# Altium schematic sheet picr22-team-GibiBot-mainboard1.SchDoc
size A4; SheetNumber: 1; SheetTotal: 2
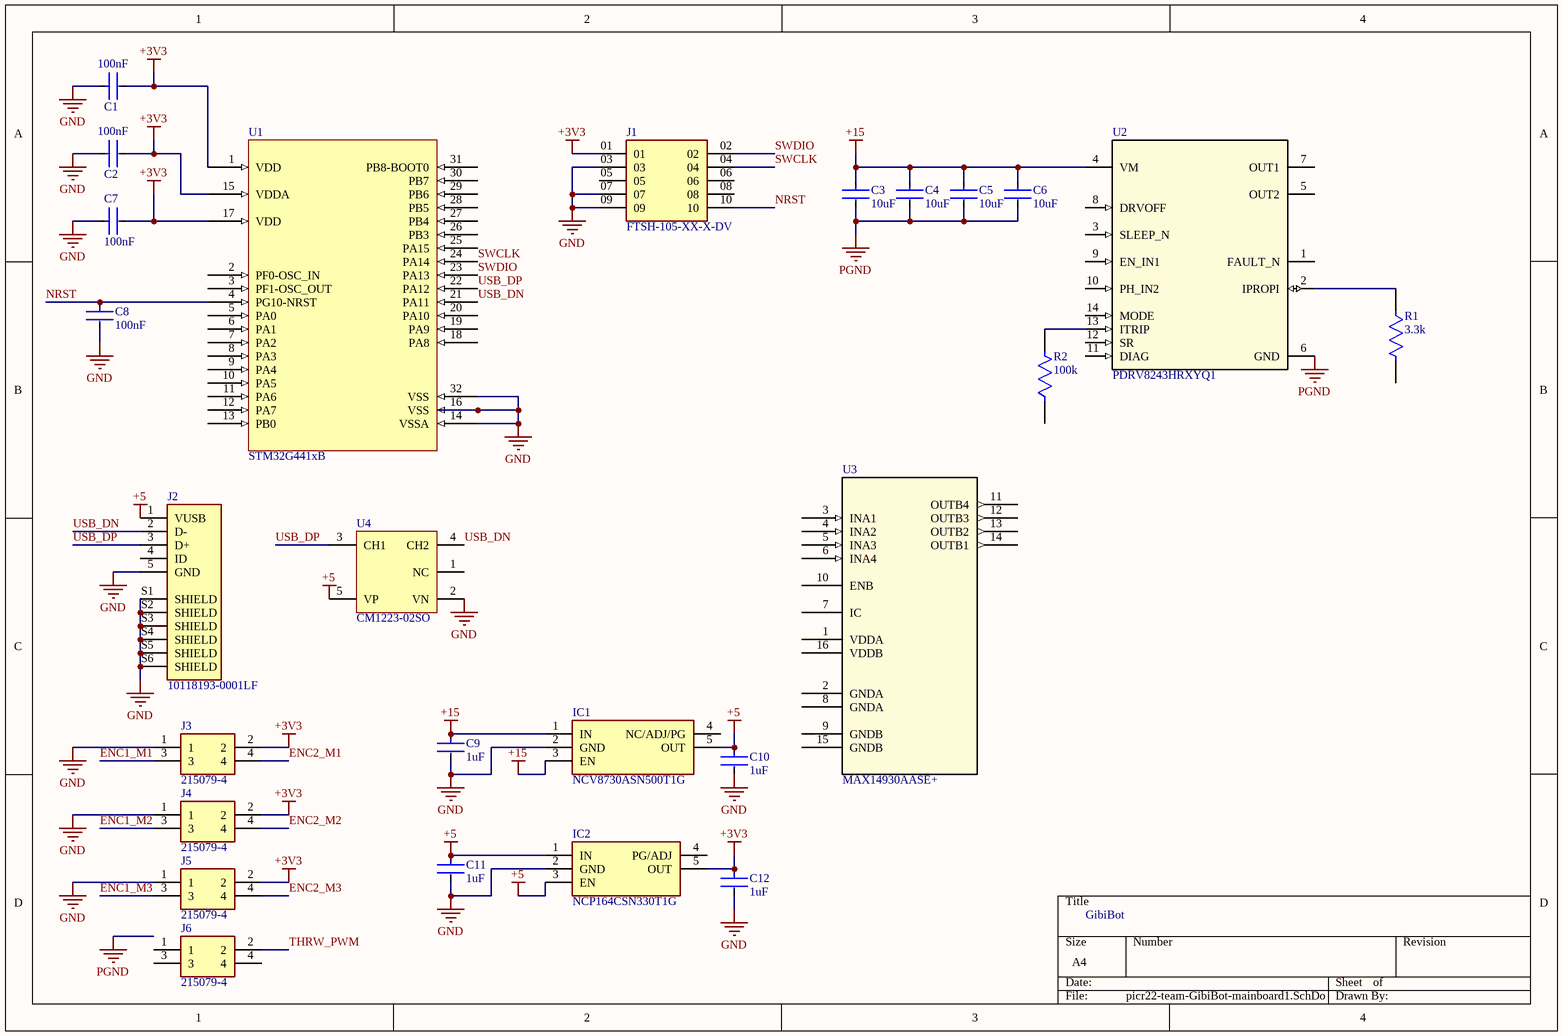
[diagram p0: picr22-team-GibiBot-mainboard1.SchDoc]

## Parts
C1  Capacitance: 100nF  [FP-CGA3E-0_3-0_1-IPC_A]  (hidden comment: CGA3E2X7R1H104K080AA)
C2  Capacitance: 100nF  [FP-CGA3E-0_3-0_1-IPC_A]  (hidden comment: CGA3E2X7R1H104K080AA)
C3  Capacitance: 10uF  [FP-CGA3E-0_3-0_1-IPC_A]  (hidden comment: CGA3E2X7R1H104K080AA)
C4  Capacitance: 10uF  [FP-CGA3E-0_3-0_1-IPC_A]  (hidden comment: CGA3E2X7R1H104K080AA)
C5  Capacitance: 10uF  [FP-CGA3E-0_3-0_1-IPC_A]  (hidden comment: CGA3E2X7R1H104K080AA)
C6  Capacitance: 10uF  [FP-CGA3E-0_3-0_1-IPC_A]  (hidden comment: CGA3E2X7R1H104K080AA)
C7  Capacitance: 100nF  [FP-CGA3E-0_3-0_1-IPC_A]  (hidden comment: CGA3E2X7R1H104K080AA)
C8  Capacitance: 100nF  [FP-CGA3E-0_3-0_1-IPC_A]  (hidden comment: CGA3E2X7R1H104K080AA)
C9  Capacitance: 1uF  [FP-CGA3E-0_3-0_1-IPC_A]  (hidden comment: CGA3E2X7R1H104K080AA)
C10  Capacitance: 1uF  [FP-CGA3E-0_3-0_1-IPC_A]  (hidden comment: CGA3E2X7R1H104K080AA)
C11  Capacitance: 1uF  [FP-CGA3E-0_3-0_1-IPC_A]  (hidden comment: CGA3E2X7R1H104K080AA)
C12  Capacitance: 1uF  [FP-CGA3E-0_3-0_1-IPC_A]  (hidden comment: CGA3E2X7R1H104K080AA)
IC1  NCV8730ASN500T1G  [SOT95P275X110-5N]
IC2  NCP164CSN330T1G  [SOT95P275X110-5N]
J1  FTSH-105-XX-X-DV  [SAMTEC_FTSH-105-XX-X-DV]
J2  10118193-0001LF  [FCI_10118193-0001LF]
J3  215079-4  [TE_215079-4]
J4  215079-4  [TE_215079-4]
J5  215079-4  [TE_215079-4]
J6  215079-4  [TE_215079-4]
R1  Resistance: 3.3k  [FP-CRCW0402-e3-MFG]  (hidden comment: CRCW040232K4FKED)
R2  Resistance: 100k  [FP-CRCW0402-e3-MFG]  (hidden comment: CRCW040232K4FKED)
U1  STM32G441xB  [TQFP80P900X900X160-32N]
U2  PDRV8243HRXYQ1  [RXY0014A-MFG]
U3  MAX14930AASE+  [21-0041_S16+1_MXM]
U4  CM1223-02SO  [ONSC-SOT23-5-527AH-01_L]

## Nets
+3V3: C1.2 C2.2 C7.2 C12.1 IC2.5(OUT) J1.01 J3.2 J4.2 J5.2 U1.1(VDD) U1.15(VDDA) U1.17(VDD)
+5: C10.1 C11.1 IC1.5(OUT) IC2.1(IN) IC2.3(EN) J2.1(VUSB) U4.5(VP)
+15: C3.1 C4.1 C5.1 C6.1 C9.1 IC1.1(IN) IC1.3(EN) U2.4(VM)
GND: C1.1 C2.1 C7.1 C8.2 C9.2 C10.2 C11.2 C12.2 IC1.2(GND) IC2.2(GND) J1.03 J1.07 J1.09 J2.5(GND) J2.S1(SHIELD) J2.S2(SHIELD) J2.S3(SHIELD) J2.S4(SHIELD) J2.S5(SHIELD) J2.S6(SHIELD) J3.1 J4.1 J5.1 U1.14(VSSA) U1.16(VSS) U1.32(VSS) U4.2(VN)
PGND: C3.2 C4.2 C5.2 C6.2 U2.6(GND)
ENC1_M1: J3.3
ENC1_M2: J4.3
ENC1_M3: J5.3
ENC2_M1: J3.4
ENC2_M2: J4.4
ENC2_M3: J5.4
NRST: C8.1 J1.10 U1.4(PG10-NRST)
SWCLK: J1.04 U1.24(PA14)
SWDIO: J1.02 U1.23(PA13)
THRW_PWM: J6.2
USB_DN: J2.2(D-) U1.21(PA11) U4.4(CH2)
USB_DP: J2.3(D+) U1.22(PA12) U4.3(CH1)
NetR1_1: R1.1 U2.2(IPROPI)
NetR2_2: R2.2 U2.13(ITRIP)

Not connected (* = marked no-connect by the designer): IC1 4(NC/ADJ/PG); IC2 4(PG/ADJ); J1 05 06 08; J2 4(ID); J6 1 3 4; R1 2; R2 1; U1 2(PF0-OSC_IN) 3(PF1-OSC_OUT) 5(PA0) 6(PA1) 7(PA2) 8(PA3) 9(PA4) 10(PA5) 11(PA6) 12(PA7) 13(PB0) 18(PA8) 19(PA9) 20(PA10) 25(PA15) 26(PB3) 27(PB4) 28(PB5) 29(PB6) 30(PB7) 31(PB8-BOOT0); U2 1(FAULT_N) 3(SLEEP_N) 5(OUT2) 7(OUT1) 8(DRVOFF) 9(EN_IN1) 10(PH_IN2) 11(DIAG) 12(SR) 14(MODE); U3 1(VDDA) 2(GNDA) 3(INA1) 4(INA2) 5(INA3) 6(INA4) 7(IC) 8(GNDA) 9(GNDB) 10(ENB) 11(OUTB4) 12(OUTB3) 13(OUTB2) 14(OUTB1) 15(GNDB) 16(VDDB); U4 1(NC)

## Notes on the sheet
- GibiBot

## Library data of the parts
C1-C12 = CMP-2000-07546-2: Cap Ceramic 100nF 50V X7R 10% Pad SMD 0603 +125°C Automotive T/R; Weight: 7.1E-05oz; Composition: Ceramic; Max Operating Temperature: 125°C; Termination: SMD/SMT; Dielectric: X7R; Length: 1.6mm; Package Quantity: 1; REACH SVHC: No SVHC; Lead Free: Lead Free; Case Code (Metric): 1608; Min Operating Temperature: -55°C; Packaging: Tape and Reel; Tolerance: 10%; Voltage Rating: 50V; Case Code (Imperial): 0603; Case/Package: 0603; Voltage Rating (DC): 50V; Depth: 0.8mm; Radiation Hardening: No; Ratings: AEC-Q200; Mount: Surface Mount; Voltage: 50V; Thickness: 0.035inch; Width: 0.8mm; Height: 0.8mm
IC1 = NCV8730ASN500T1G: Integrated Circuit; Manufacturer_Name: onsemi; Datasheet Link: https://www.arrow.com/en/products/ncv8730asn500t1g/on-semiconductor; Height: 1.1mm; Manufacturer_Part_Number: NCV8730ASN500T1G; Mouser Part Number: 863-NCV8730ASN500T1G; Mouser Price/Stock: https://www.mouser.co.uk/ProductDetail/onsemi/NCV8730ASN500T1G?qs=GedFDFLaBXHk1ABQHGw1TA%3D%3D; Arrow Part Number: NCV8730ASN500T1G; Arrow Price/Stock: https://www.arrow.com/en/products/ncv8730asn500t1g/on-semiconductor
IC2 = NCP164CSN330T1G: Integrated Circuit; Manufacturer_Name: onsemi; Datasheet Link: https://componentsearchengine.com/Datasheets/2/NCP164CSN330T1G.pdf; Height: 1.1mm; Manufacturer_Part_Number: NCP164CSN330T1G; Mouser Part Number: 863-NCP164CSN330T1G; Mouser Price/Stock: https://www.mouser.co.uk/ProductDetail/onsemi/NCP164CSN330T1G?qs=xZ%2FP%252Ba9zWqbi%2FAyy5UtoRw%3D%3D; Arrow Part Number: NCP164CSN330T1G; Arrow Price/Stock: https://www.arrow.com/en/products/ncp164csn330t1g/on-semiconductor?region=nac
J1 = FTSH-105-XX-X-DV: Connector Header Surface Mount 10 position 0.050" (1.27mm); Availability: Unavailable; Package: None; MP: FTSH-105-XX-X-DV; Price: None; Value: *
J2 = 10118193-0001LF: USB - micro B USB 2.0 Receptacle Connector 5 Position Surface Mount, Right Angle; Through Hole; MF: Amphenol ICC; Availability: Unavailable; SnapEDA_Link: https://www.snapeda.com/parts/10118193-0001LF/Amphenol%20FCI/view-part/2758989/?ref=snap; MP: 10118193-0001LF; Price: None; Value: *; Package: None
J3-J6 = 215079-4: 4 Position Receptacle Connector Through Hole; MF: TE Connectivity; Price: None; Availability: Unavailable; SnapEDA_Link: https://www.snapeda.com/parts/215079-4/TE%20Connectivity%20AMP%20Connectors/view-part/2366486/?ref=snap; EU_RoHS_Compliance: Compliant; Value: *; MP: 215079-4; TE_purchase_URL: https://www.te.com/usa-en/product-215079-4.html?te_bu=Cor&te_type=disp&te_campaign=seda_glo_cor-seda-global-disp-prtnr-fy19-seda-model-bom-cta_sma-317_1&elqCampaignId=32493; Package: SMD-6 Omron Electronics
R1 R2 = CMP-2002-08519-2: RES Thick Film, 32.4kΩ, 1%, 0.063W, 100ppm/°C, 0402; Voltage Rating: 50V; Max Power Dissipation: 63mW; Min Operating Temperature: -55°C; Width: 0.5mm; Number of Pins: 2; Contact Plating: Tin; Weight: 2.3E-05oz; Features: Automotive AEC-Q200; Case/Package: 0402; Case Code (Imperial): 0402; Number of Terminations: 2; Height: 0.35mm; Packaging: Tape and Reel; Radiation Hardening: No; Package Quantity: 10; Composition: Thick Film; Termination: SMD/SMT; Temperature Coefficient: 100ppm/°C; Length: 1mm; Depth: 0.5mm; Power Rating: 63mW; Tolerance: 1%; Max Operating Temperature: 155°C; Case Code (Metric): 1005; Military Standard: Not
U2 = PDRV8243HRXYQ1: No Description Available; Mfr_Name: Texas Instruments; Type: DEV; RefDes: RefDes; Copyright: Copyright (C) 2022 Ultra Librarian. All rights reserved.; Manufacturer_Part_Number: PDRV8243HRXYQ1
U3 = MAX14930AASE+: No Description Available; Mfr_Name: Maxim Integrated Products; Copyright: Copyright (C) 2022 Ultra Librarian. All rights reserved.; Manufacturer_Part_Number: MAX14930AASE+; RefDes: RefDes; Type: DEV
U4 = CMP-1063-00173-1: Industry First Low Capacitance ESD Protection Arrays with Backdrive Protection, 5-Pin SOT-23, Pb-Free, Tape and Reel; Manufacturer: On Semiconductor; Direction: Unidirectional; PPK Max (W): 0.225; C Max (pF): 1.5; Number of Lines: 2; ComponentLink1Description: Manufacturer URL; PackageReference: SOT23-5-527AH-01; ComponentLink3URL: http://www.onsemi.com/pub_link/Collateral/527AH.PDF; ComponentLink1URL: http://www.onsemi.com/; PackageDescription: 5-Pin Small Outline Transistor, Body 2.9 x 1.6 mm, Pitch 0.95 mm; ComponentLink2URL: http://www.onsemi.com/pub_link/Collateral/CM1223-D.PDF; PackageVersion: Rev. O, 12/2008; ComponentLink3Description: Package Specification; PartNumber: CM1223-02SO; DatasheetVersion: Rev. 6; RoHS: Pb-Free; Code_JEDEC: MO-178; ComponentLink2Description: Datasheet; Packing: Tape and Reel; Mounting Technology: Surface Mount